# Altium schematic sheet CurrentSense.SchDoc
size A
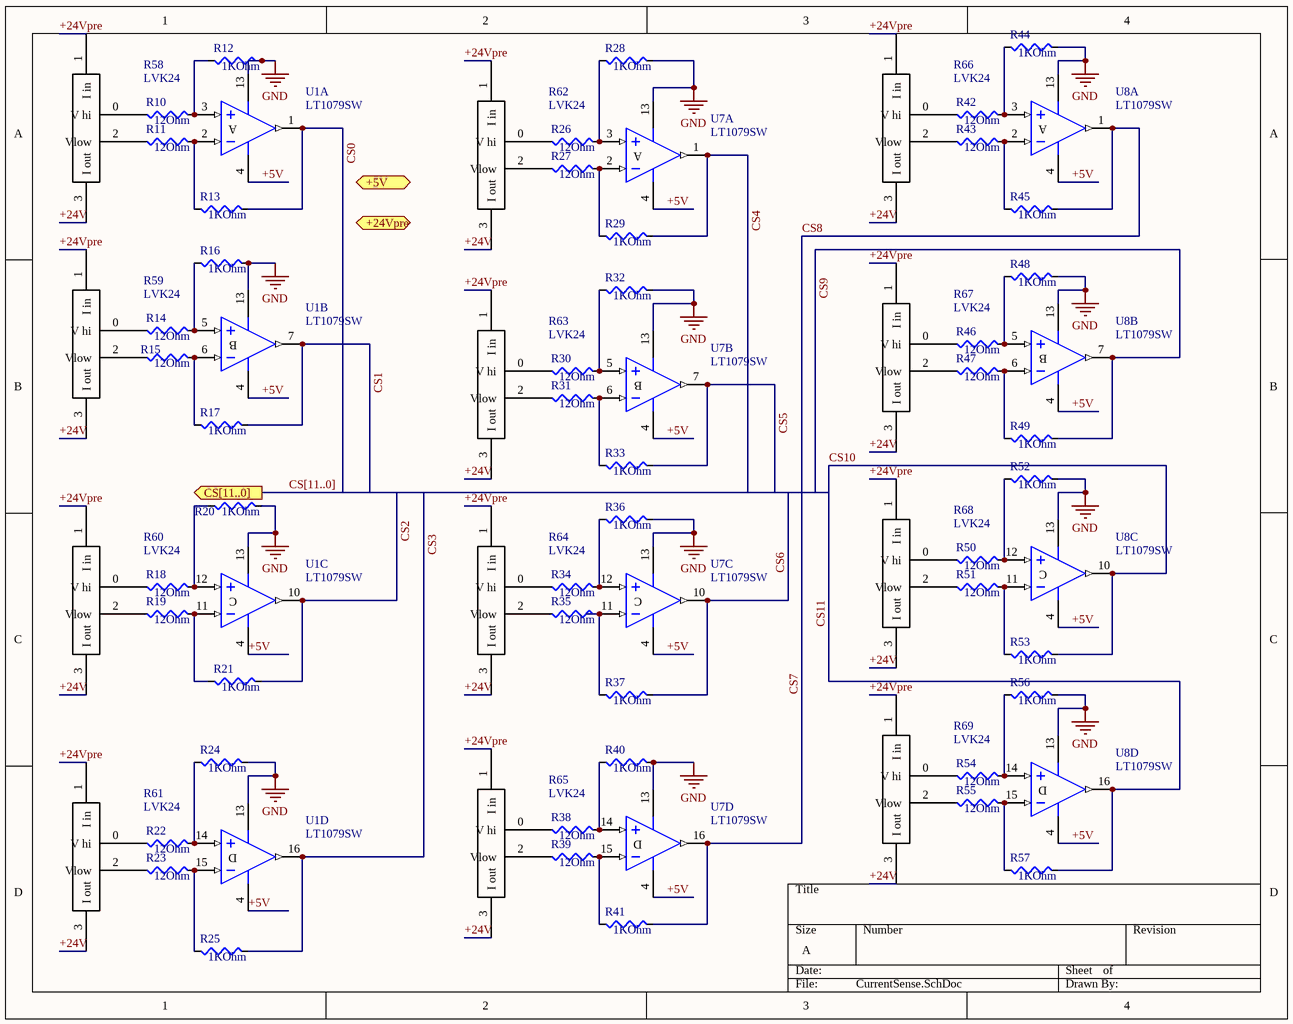
[diagram p0: CurrentSense.SchDoc]

## Parts
R10  12Ohm  [R 0805 (2012) RESISTOR]
R11  12Ohm  [R 0805 (2012) RESISTOR]
R12  1KOhm  [R 0805 (2012) RESISTOR]
R13  1KOhm  [R 0805 (2012) RESISTOR]
R14  12Ohm  [R 0805 (2012) RESISTOR]
R15  12Ohm  [R 0805 (2012) RESISTOR]
R16  1KOhm  [R 0805 (2012) RESISTOR]
R17  1KOhm  [R 0805 (2012) RESISTOR]
R18  12Ohm  [R 0805 (2012) RESISTOR]
R19  12Ohm  [R 0805 (2012) RESISTOR]
R20  1KOhm  [R 0805 (2012) RESISTOR]
R21  1KOhm  [R 0805 (2012) RESISTOR]
R22  12Ohm  [R 0805 (2012) RESISTOR]
R23  12Ohm  [R 0805 (2012) RESISTOR]
R24  1KOhm  [R 0805 (2012) RESISTOR]
R25  1KOhm  [R 0805 (2012) RESISTOR]
R26  12Ohm  [R 0805 (2012) RESISTOR]
R27  12Ohm  [R 0805 (2012) RESISTOR]
R28  1KOhm  [R 0805 (2012) RESISTOR]
R29  1KOhm  [R 0805 (2012) RESISTOR]
R30  12Ohm  [R 0805 (2012) RESISTOR]
R31  12Ohm  [R 0805 (2012) RESISTOR]
R32  1KOhm  [R 0805 (2012) RESISTOR]
R33  1KOhm  [R 0805 (2012) RESISTOR]
R34  12Ohm  [R 0805 (2012) RESISTOR]
R35  12Ohm  [R 0805 (2012) RESISTOR]
R36  1KOhm  [R 0805 (2012) RESISTOR]
R37  1KOhm  [R 0805 (2012) RESISTOR]
R38  12Ohm  [R 0805 (2012) RESISTOR]
R39  12Ohm  [R 0805 (2012) RESISTOR]
R40  1KOhm  [R 0805 (2012) RESISTOR]
R41  1KOhm  [R 0805 (2012) RESISTOR]
R42  12Ohm  [R 0805 (2012) RESISTOR]
R43  12Ohm  [R 0805 (2012) RESISTOR]
R44  1KOhm  [R 0805 (2012) RESISTOR]
R45  1KOhm  [R 0805 (2012) RESISTOR]
R46  12Ohm  [R 0805 (2012) RESISTOR]
R47  12Ohm  [R 0805 (2012) RESISTOR]
R48  1KOhm  [R 0805 (2012) RESISTOR]
R49  1KOhm  [R 0805 (2012) RESISTOR]
R50  12Ohm  [R 0805 (2012) RESISTOR]
R51  12Ohm  [R 0805 (2012) RESISTOR]
R52  1KOhm  [R 0805 (2012) RESISTOR]
R53  1KOhm  [R 0805 (2012) RESISTOR]
R54  12Ohm  [R 0805 (2012) RESISTOR]
R55  12Ohm  [R 0805 (2012) RESISTOR]
R56  1KOhm  [R 0805 (2012) RESISTOR]
R57  1KOhm  [R 0805 (2012) RESISTOR]
R58  LVK24  [LVK24 Ohmite]
R59  LVK24  [LVK24 Ohmite]
R60  LVK24  [LVK24 Ohmite]
R61  LVK24  [LVK24 Ohmite]
R62  LVK24  [LVK24 Ohmite]
R63  LVK24  [LVK24 Ohmite]
R64  LVK24  [LVK24 Ohmite]
R65  LVK24  [LVK24 Ohmite]
R66  LVK24  [LVK24 Ohmite]
R67  LVK24  [LVK24 Ohmite]
R68  LVK24  [LVK24 Ohmite]
R69  LVK24  [LVK24 Ohmite]
U1  LT1079SW  [SW16_N]  (parts A,B,C,D of 4)
U7  LT1079SW  [SW16_N]  (parts A,B,C,D of 4)
U8  LT1079SW  [SW16_N]  (parts A,B,C,D of 4)

## Ports
+5V, +24Vpre, CS[11..0] (out)

## Nets
GND: R12.2 R16.2 R20.2 R24.2 R28.2 R32.2 R36.2 R40.2 R44.2 R48.2 R52.2 R56.2 U1.13(V-) U7.13(V-) U8.13(V-)
+5V: U1.4(V+) U7.4(V+) U8.4(V+)
+24V: R58.3(I_out) R59.3(I_out) R60.3(I_out) R61.3(I_out) R62.3(I_out) R63.3(I_out) R64.3(I_out) R65.3(I_out) R66.3(I_out) R67.3(I_out) R68.3(I_out) R69.3(I_out)
+24Vpre: R58.1(I_in) R59.1(I_in) R60.1(I_in) R61.1(I_in) R62.1(I_in) R63.1(I_in) R64.1(I_in) R65.1(I_in) R66.1(I_in) R67.1(I_in) R68.1(I_in) R69.1(I_in)
CS0: R13.2 U1.1(OUT)
CS1: R17.2 U1.7(OUT)
CS2: R21.2 U1.10(OUT)
CS3: R25.2 U1.16(OUT)
CS4: R29.2 U7.1(OUT)
CS5: R33.2 U7.7(OUT)
CS6: R37.2 U7.10(OUT)
CS7: R41.2 R45.2 U7.16(OUT) U8.1(OUT)  [also labelled CS8]
CS9: R49.2 U8.7(OUT)
CS10: R53.2 R57.2 U8.10(OUT) U8.16(OUT)  [also labelled CS11]
NetR10_1: R10.1 R58.0(V_hi)
NetR10_2: R10.2 R12.1 U1.3(IN+)
NetR11_1: R11.1 R58.2(Vlow)
NetR11_2: R11.2 R13.1 U1.2(IN-)
NetR14_1: R14.1 R59.0(V_hi)
NetR14_2: R14.2 R16.1 U1.5(IN+)
NetR15_1: R15.1 R59.2(Vlow)
NetR15_2: R15.2 R17.1 U1.6(IN-)
NetR18_1: R18.1 R60.0(V_hi)
NetR18_2: R18.2 R20.1 U1.12(IN+)
NetR19_1: R19.1 R60.2(Vlow)
NetR19_2: R19.2 R21.1 U1.11(IN-)
NetR22_1: R22.1 R61.0(V_hi)
NetR22_2: R22.2 R24.1 U1.14(IN+)
NetR23_1: R23.1 R61.2(Vlow)
NetR23_2: R23.2 R25.1 U1.15(IN-)
NetR26_1: R26.1 R62.0(V_hi)
NetR26_2: R26.2 R28.1 U7.3(IN+)
NetR27_1: R27.1 R62.2(Vlow)
NetR27_2: R27.2 R29.1 U7.2(IN-)
NetR30_1: R30.1 R63.0(V_hi)
NetR30_2: R30.2 R32.1 U7.5(IN+)
NetR31_1: R31.1 R63.2(Vlow)
NetR31_2: R31.2 R33.1 U7.6(IN-)
NetR34_1: R34.1 R64.0(V_hi)
NetR34_2: R34.2 R36.1 U7.12(IN+)
NetR35_1: R35.1 R64.2(Vlow)
NetR35_2: R35.2 R37.1 U7.11(IN-)
NetR38_1: R38.1 R65.0(V_hi)
NetR38_2: R38.2 R40.1 U7.14(IN+)
NetR39_1: R39.1 R65.2(Vlow)
NetR39_2: R39.2 R41.1 U7.15(IN-)
NetR42_1: R42.1 R66.0(V_hi)
NetR42_2: R42.2 R44.1 U8.3(IN+)
NetR43_1: R43.1 R66.2(Vlow)
NetR43_2: R43.2 R45.1 U8.2(IN-)
NetR46_1: R46.1 R67.0(V_hi)
NetR46_2: R46.2 R48.1 U8.5(IN+)
NetR47_1: R47.1 R67.2(Vlow)
NetR47_2: R47.2 R49.1 U8.6(IN-)
NetR50_1: R50.1 R68.0(V_hi)
NetR50_2: R50.2 R52.1 U8.12(IN+)
NetR51_1: R51.1 R68.2(Vlow)
NetR51_2: R51.2 R53.1 U8.11(IN-)
NetR54_1: R54.1 R69.0(V_hi)
NetR54_2: R54.2 R56.1 U8.14(IN+)
NetR55_1: R55.1 R69.2(Vlow)
NetR55_2: R55.2 R57.1 U8.15(IN-)

## Buses and harness runs
bus CS[11..0] = port CS[11..0]

## Notes on the sheet
- (in symbol LT1079SW, part A) A
- (in symbol LT1079SW, part B) B
- (in symbol LT1079SW, part C) C
- (in symbol LT1079SW, part D) D

## Library data of the parts
R10-R57 = Resistor: Value: 0Ohm
U1 U7 U8 = LT1079SW: Micropower, Quad, Single Supply, Precision Operational Amplifier; Note: Pins 8 and 9 are NC (not internally connected) pins and are not drawn.; Note: 436; Published: 8-Jun-2000; LatestRevisionDate: 13-Apr-2006; LatestRevisionNote: IPC-7351 Footprint Added.; DatasheetVersion: 1996; PackageVersion: S16 (WIDE) 0502; PackageReference: SW16; Publisher: Altium Limited; PackageDescription: 16-Pin Plastic Small Outline Integrated Circuit 1.27 mm Pitch; Code_JEDEC: MS-013-AA; Code_IPC: SOIC127P1030-16; ComponentLink1Description: Manufacturer Link; ComponentLink1URL: http://www.linear.com/; ComponentLink2Description: Datasheet; ComponentLink2URL: http://www.linear.com/pc/downloadDocument.do?navId=H0,C1,C1154,C1009,C1099,P1277,D1716